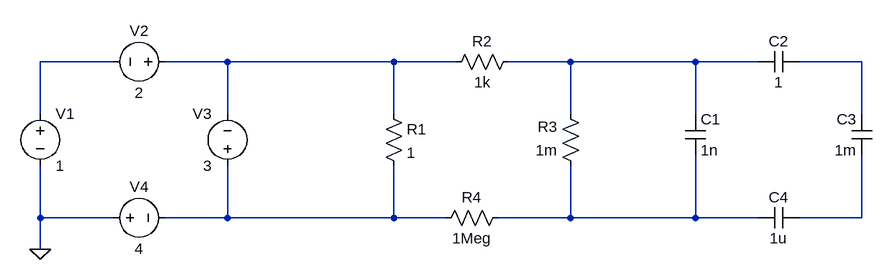
[diagram p0: schematic orientation_test.asc]
orientation_test.asc, the LTspice schematic file:
Version 4
SHEET 1 1316 680
WIRE 144 176 32 176
WIRE 320 176 224 176
WIRE 576 176 320 176
WIRE 672 176 576 176
WIRE 848 176 752 176
WIRE 1040 176 848 176
WIRE 1136 176 1040 176
WIRE 1296 176 1200 176
WIRE 32 256 32 176
WIRE 320 256 320 176
WIRE 576 256 576 176
WIRE 848 256 848 176
WIRE 1040 256 1040 176
WIRE 1296 256 1296 176
WIRE 32 416 32 336
WIRE 144 416 32 416
WIRE 320 416 320 336
WIRE 320 416 224 416
WIRE 576 416 576 336
WIRE 576 416 320 416
WIRE 656 416 576 416
WIRE 848 416 848 336
WIRE 848 416 736 416
WIRE 1040 416 1040 320
WIRE 1040 416 848 416
WIRE 1136 416 1040 416
WIRE 1296 416 1296 320
WIRE 1296 416 1200 416
WIRE 32 464 32 416
FLAG 32 464 0
SYMBOL voltage 32 240 R0
SYMATTR InstName V1
SYMATTR Value 1
SYMBOL voltage 240 176 R90
WINDOW 0 -32 56 VBottom 2
WINDOW 3 32 56 VTop 2
SYMATTR InstName V2
SYMATTR Value 2
SYMBOL voltage 320 352 R180
WINDOW 0 24 96 Left 2
WINDOW 3 24 16 Left 2
SYMATTR InstName V3
SYMATTR Value 3
SYMBOL voltage 128 416 R270
WINDOW 0 32 56 VTop 2
WINDOW 3 -32 56 VBottom 2
SYMATTR InstName V4
SYMATTR Value 4
SYMBOL res 560 240 R0
SYMATTR InstName R1
SYMATTR Value 1
SYMBOL res 768 160 R90
WINDOW 0 0 56 VBottom 2
WINDOW 3 32 56 VTop 2
SYMATTR InstName R2
SYMATTR Value 1k
SYMBOL res 864 352 R180
WINDOW 0 36 76 Left 2
WINDOW 3 36 40 Left 2
SYMATTR InstName R3
SYMATTR Value 1m
SYMBOL res 640 432 R270
WINDOW 0 32 56 VTop 2
WINDOW 3 0 56 VBottom 2
SYMATTR InstName R4
SYMATTR Value 1Meg
SYMBOL cap 1024 256 R0
SYMATTR InstName C1
SYMATTR Value 1n
SYMBOL cap 1200 160 R90
WINDOW 0 0 32 VBottom 2
WINDOW 3 32 32 VTop 2
SYMATTR InstName C2
SYMATTR Value 1
SYMBOL cap 1312 320 R180
WINDOW 0 24 56 Left 2
WINDOW 3 24 8 Left 2
SYMATTR InstName C3
SYMATTR Value 1m
SYMBOL cap 1136 432 R270
WINDOW 0 32 32 VTop 2
WINDOW 3 0 32 VBottom 2
SYMATTR InstName C4
SYMATTR Value 1u

The netlist it stands for:
* orientation_test.asc
V1 N001 0 1
V2 N002 N001 2
V3 N005 N002 3
V4 0 N005 4
R1 N002 N005 1
R2 N003 N002 1k
R3 N006 N003 1m
R4 N005 N006 1Meg
C1 N003 N006 1n
C2 N004 N003 1
C3 N007 N004 1m
C4 N006 N007 1u
.backanno
.end